# Altium schematic sheet Connectors.SchDoc
size 393 x 281 mm; DocumentNumber: 4; SheetNumber: 4; SheetTotal: 7; Format: A3; Abteilung: Entwicklung
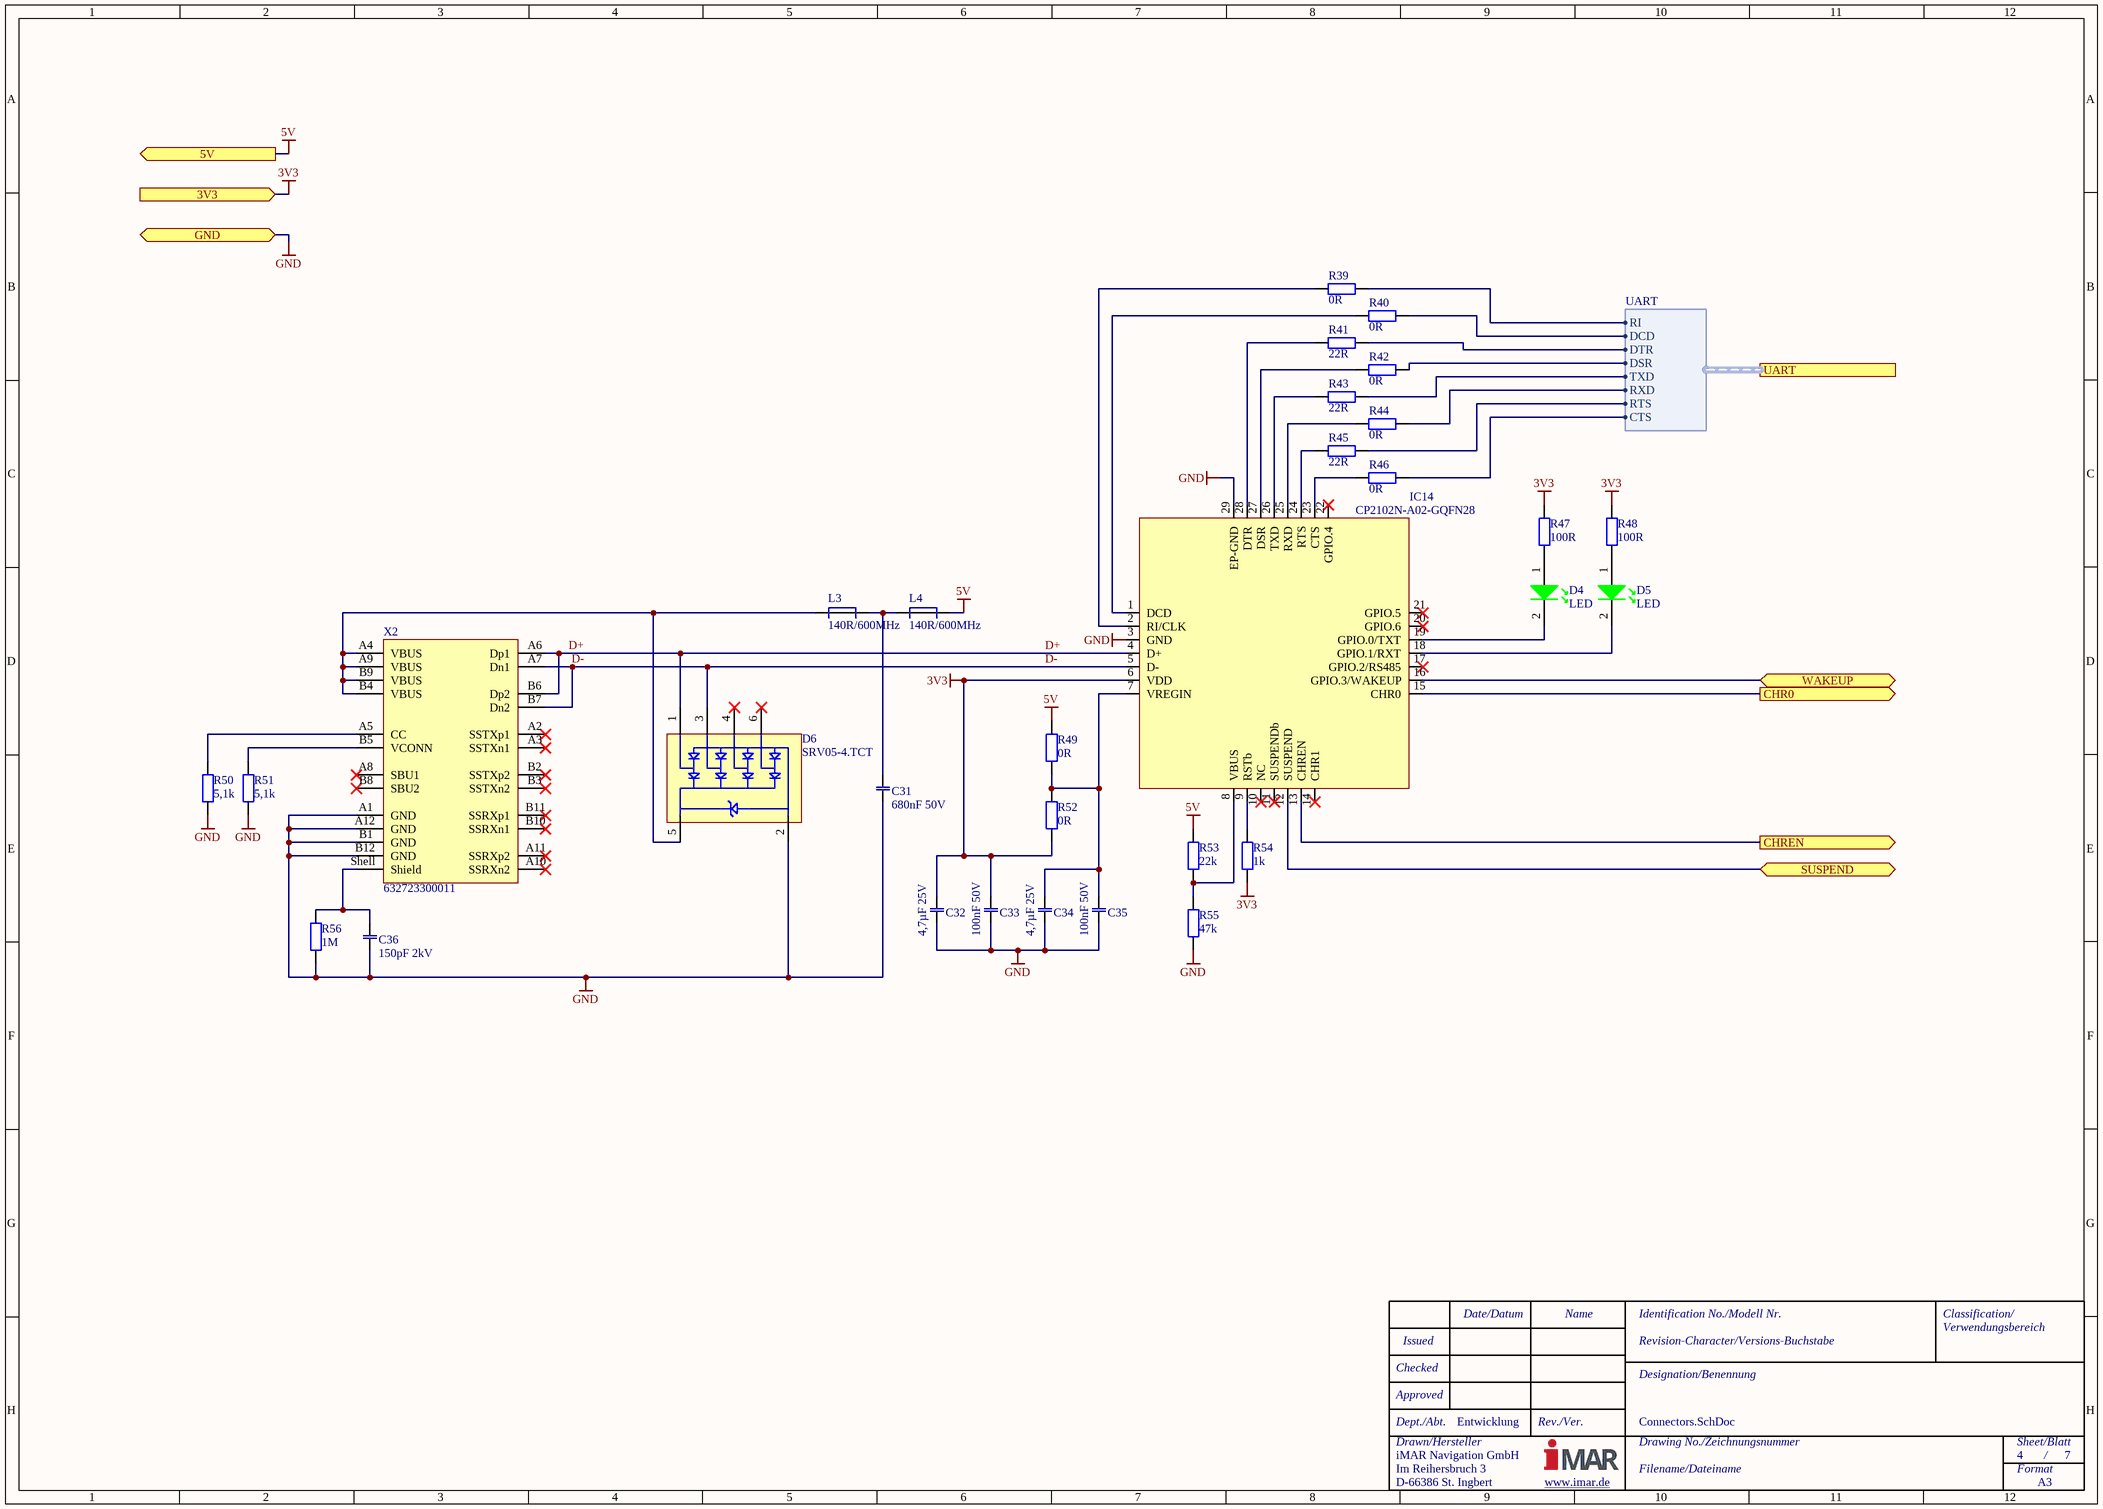
[diagram p0: Connectors.SchDoc]

## Parts
C31  680nF 50V  [CAPC1608L]
C32  4,7µF 25V  [CAPC1608L]
C33  100nF 50V  [CAPC1005N]
C34  4,7µF 25V  [CAPC1608L]
C35  100nF 50V  [CAPC1005N]
C36  150pF 2kV  [CAPC3216L]
D4  LED  [LEDM1608X11_Green]
D5  LED  [LEDM1608X11_Green]
D6  SRV05-4.TCT  [SOT95P280X110-6N]
IC14  CP2102N-A02-GQFN28  [QFN50P500X500X80_HS-29N]
L3  140R/600MHz  [INDC1005X06N]
L4  140R/600MHz  [INDC1005X06N]
R39  0R  [RESC1005L]
R40  0R  [RESC1005L]
R41  22R  [RESC1005L]
R42  0R  [RESC1005L]
R43  22R  [RESC1005L]
R44  0R  [RESC1005L]
R45  22R  [RESC1005L]
R46  0R  [RESC1005L]
R47  100R  [RESC1005L]
R48  100R  [RESC1005L]
R49  0R  [RESC1005L]
R50  5,1k  [RESC1005L]
R51  5,1k  [RESC1005L]
R52  0R  [RESC1005L]
R53  22k  [RESC1005L]
R54  1k  [RESC1005L]
R55  47k  [RESC1005L]
R56  1M  [RESC2012L]
X2  632723300011  [WE_632723300011]

## Ports
3V3 (in), 5V (out), CHR0 (out), CHREN (out), GND (bidir), SUSPEND (bidir), UART (harness UART), WAKEUP (bidir)

## Harnesses
UART: RXD, DSR, DTR, RTS, CTS, TXD, DCD, RI

## Nets
3V3: C32.2 C33.2 IC14.6(VDD) R47.2 R48.2 R52.2 R54.1 ; port 3V3
5V: L4.2 R49.2 R53.2 ; port 5V
GND: C31.1 C32.1 C33.1 C34.1 C35.1 C36.1 D6.2 IC14.3(GND) IC14.29(EP-GND) R50.1 R51.1 R55.1 R56.1 X2.A1(GND) X2.A12(GND) X2.B1(GND) X2.B12(GND) ; port GND
CHR0: IC14.15(CHR0) ; port CHR0
CHREN: IC14.13(CHREN) ; port CHREN
D+: D6.1 IC14.4(D+) X2.A6(Dp1) X2.B6(Dp2)
D-: D6.3 IC14.5(D-) X2.A7(Dn1) X2.B7(Dn2)
SUSPEND: IC14.12(SUSPEND) ; port SUSPEND
WAKEUP: IC14.16(GPIO.3/WAKEUP) ; port WAKEUP
NetC31_2: C31.2 L3.2 L4.1
NetC34_2: C34.2 C35.2 IC14.7(VREGIN) R49.1 R52.1
NetC36_2: C36.2 R56.2 X2.Shell(Shield)
NetD4_1: D4.1 R47.1
NetD4_2: D4.2 IC14.19(GPIO.0/TXT)
NetD5_1: D5.1 R48.1
NetD5_2: D5.2 IC14.18(GPIO.1/RXT)
NetD6_5: D6.5 L3.1 X2.A4(VBUS) X2.A9(VBUS) X2.B4(VBUS) X2.B9(VBUS)
NetIC14_1: IC14.1(DCD) R40.1
NetIC14_2: IC14.2(RI/CLK) R39.1
NetIC14_8: IC14.8(VBUS) R53.1 R55.2
NetIC14_9: IC14.9(RSTb) R54.2
NetIC14_23: IC14.23(CTS) R46.1
NetIC14_24: IC14.24(RTS) R45.2
NetIC14_25: IC14.25(RXD) R44.1
NetIC14_26: IC14.26(TXD) R43.1
NetIC14_27: IC14.27(DSR) R42.1
NetIC14_28: IC14.28(DTR) R41.2
NetR39_2: R39.2 ; port UART.RI
NetR40_2: R40.2 ; port UART.DCD
NetR41_1: R41.1 ; port UART.DTR
NetR42_2: R42.2 ; port UART.DSR
NetR43_2: R43.2 ; port UART.TXD
NetR44_2: R44.2 ; port UART.RXD
NetR45_1: R45.1 ; port UART.RTS
NetR46_2: R46.2 ; port UART.CTS
NetR50_2: R50.2 X2.A5(CC)
NetR51_2: R51.2 X2.B5(VCONN)

Not connected (* = marked no-connect by the designer): D6 4* 6*; IC14 10(NC)* 11(SUSPENDb)* 14(CHR1)* 17(GPIO.2/RS485)* 20(GPIO.6)* 21(GPIO.5)* 22(GPIO.4)*; X2 A2(SSTXp1)* A3(SSTXn1)* A8(SBU1)* A10(SSRXn2)* A11(SSRXp2)* B2(SSTXp2)* B3(SSTXn2)* B8(SBU2)* B10(SSRXn1)* B11(SSRXp1)*

## Notes on the sheet
- Date/Datum
- Name
- Identification No./Modell Nr.
- Classification/
- Checked
- Approved
- Issued
- Designation/Benennung
- Revision-Character/Versions-Buchstabe
- Verwendungsbereich
- Drawn/Hersteller
- Dept./Abt.
- iMAR Navigation GmbH
- Rev./Ver.
- Drawing No./Zeichnungsnummer
- Sheet/Blatt
- /
- Im Reihersbruch 3
- D-66386 St. Ingbert
- www.imar.de <http://www.imar.de>
- Filename/Dateiname
- Format
- A3

## Library data of the parts
C31 = CMP-002-0039-17: 680nF  50V  Ceramic  0603  10%  X5R; Manufacturer: unspecified; Failure_in_Time_notes: 55°C, 90% Upper Confidence Level, Daten von Wuerth verwendet; iMAR_PN: 00001-08266-0000; Temperature_max: 85°C; Failure_in_Time_value: 0,000123; Temperature_min: -55°C; Voltage: 50V; Tolerance: 10%; Kategorie: X5R; Value: 680nF; Manufacturer_PN: unspecified; RoHS: Yes; Capacitor_Type: Ceramic; Mount: SMD; iComment: 680nF 50V; Case/Package: 0603
C32 C34 = CMP-002-0204-3: 4,7µF  25V  Ceramic  0603  10%  X5R; Manufacturer_PN: unspecified; Temperature_min: -55°C; Temperature_max: 85°C; iMAR_PN: 00001-08279-0000; Failure_in_Time_notes: 55°C, 90% Upper Confidence Level, Daten von Wuerth verwendet; Failure_in_Time_value: 0,000123; iComment: 4.7µF 25V; Value: 4.7µF; RoHS: Yes; Manufacturer: unspecified; Mount: SMD; Capacitor_Type: Ceramic; Voltage: 25V; Kategorie: X5R; Tolerance: 10%; Case/Package: 0603
C33 C35 = CMP-002-0216-3: 100nF  50V  Ceramic  0402  10%  X7R; Manufacturer_PN: unspecified; Failure_in_Time_notes: 55°C, 90% Upper Confidence Level, Daten von Wuerth verwendet; Failure_in_Time_value: 0,000123; Temperature_min: -55°C; iMAR_PN: 00001-08791-0000; Temperature_max: 125°C; iComment: 100nF 50V; Capacitor_Type: Ceramic; Voltage: 50V; Mount: SMD; Case/Package: 0402; Manufacturer: unspecified; Kategorie: X7R; Tolerance: 10%; RoHS: Yes; Value: 100nF
C36 = CMP-002-0122-7: 150pF  2kV  Ceramic  1206  10%  X7R; Manufacturer: unspecified; Failure_in_Time_notes: 55°C, 90% Upper Confidence Level, Daten von Wuerth verwendet; iMAR_PN: 00001-08264-0000; Failure_in_Time_value: 0,000123; Temperature_min: -55°C; Temperature_max: 125°C; Mount: SMD; Capacitor_Type: Ceramic; RoHS: Yes; Kategorie: X7R; Value: 150pF; Tolerance: 10%; iComment: 150pF 2kV; Case/Package: 1206; Voltage: 2kV; Manufacturer_PN: unspecified
D4 D5 = CMP-008-0005-11: LED green 0603 2,2V 20mA; Manufacturer_PN: KP-1608SGC; Manufacturer: KINGBRIGHT; Temperature_max: 85°C; Uf_max: 2,5V; Ub: 5V; Temperature_min: -40°C; Uf: 2.2V; Failure_in_Time_notes: Ground Benign; MIL_HDBK_217F; Opto-Electronic/ Emitter; iMAR_PN: 00001-06615-0001; Power: 62.5mW; Failure_in_Time_value: 0,00047; Color: Green; Mount: SMD; Case/Package: 0603; Pins: 2; RoHS: Yes; If: 20mA; Type: LED
D6 = CMP-016-0045-9: Low Capacitance TVS Diode Array,USB, 10/100/1000 ETH; Manufacturer: SEMTECH; Temperature_max: 125°C; Type: TVS-Array; Failure_in_Time_value: 0,00038; Uf: 1.2V; iMAR_PN: 00001-07255-0000; Temperature_min: -55°C; Ub: 6V; Failure_in_Time_notes: 55°C (Junction), 90% Upper Confidence Level; Daten von ON Semiconductor; Power: 300W; If: 12A; Mount: SMD; Pins: 6; RoHS: Yes; Case/Package: SOT-23; Manufacturer_PN: SRV05-4.TCT
IC14 = CMP-ROOT-00311-6: USB-IC-Schnittstelle USBXpress - USB to UART Bridge; Manufacturer: SILICON LABS; iMAR_PN: 00001-09090-0000; Temperature_min: -40°C; Temperature_max: 85°C; Mount: SMD; RoHS: Yes; Case/Package: QFN28; Manufacturer_PN: CP2102N-A02-GQFN28; Pins: 29
L3 L4 = CMP-007-0093-9: 140R/600MHz  1,2A  0402  WE-CBF SMD EMI Suppression Ferrite Bead; Manufacturer: WUERTH ELEKTRONIK; Manufacturer_PN: 742792731; Temperature_max: 85°C; Temperature_min: -55°C; Failure_in_Time_value: 0,00025; Current_Rated: 1.2A; Temperature_extended: 125°C; Impedance_100MHz: 100; iMAR_PN: 00001-07703-0000; Impedance_DC: 90m; Frequency: 600MHz; Impedance: 140; Failure_in_Time_notes: 90% UCL (lambda: 0,13; sigma: 0,09); Mount: SMD; RoHS: Yes; Case/Package: 0402
R39 R40 R42 R44 R46 R49 R52 = CMP-001-0173-26: 0R  0402  0mW  0%  0ppm  0V; Manufacturer: unspecified; iMAR_PN: 00001-06483-0000; Temperature_min: -40°C; Failure_in_Time_notes: 55°C, 60% Upper Confidence Level; Daten von Vishay verwendet; iComment: 0; Power: 0W; Failure_in_Time_value: 0,0001; Value: 0; Temperature_max: 125°C; Voltage: 0V; Case/Package: 0402; Mount: SMD; Tolerance: 0%; TK: 0; RoHS: Yes; Manufacturer_PN: unspecified
R41 R43 R45 = CMP-001-0206-25: 22R  0402  62mW  1%  100ppm  50V; Manufacturer: unspecified; iComment: 22; Temperature_min: -40°C; Failure_in_Time_value: 0,0001; TK: ±100; Failure_in_Time_notes: 55°C, 60% Upper Confidence Level; Daten von Vishay verwendet; Temperature_max: 125°C; Value: 22; iMAR_PN: 00001-07283-0000; RoHS: Yes; Power: 62mW; Manufacturer_PN: unspecified; Case/Package: 0402; Tolerance: 1%; Voltage: 50V; Mount: SMD
R47 R48 = CMP-001-0222-23: 100R  0402  62mW  1%  100ppm  50V; Manufacturer_PN: unspecified; iMAR_PN: 00001-06144-0003; Failure_in_Time_notes: 55°C, 60% Upper Confidence Level; Daten von Vishay verwendet; Value: 100; Temperature_max: 125°C; Failure_in_Time_value: 0,0001; TK: ±100; Temperature_min: -40°C; RoHS: Yes; Tolerance: 1%; Power: 62mW; Case/Package: 0402; Mount: SMD; Voltage: 50V; Manufacturer: unspecified; iComment: 100
R50 R51 = CMP-001-0263-23: 5,1k  0402  62mW  1%  100ppm  50V; Manufacturer_PN: unspecified; Temperature_min: -40°C; Temperature_max: 125°C; Value: 5.1k; Failure_in_Time_value: 0,0001; TK: ±100; iMAR_PN: 00001-08410-0000; Failure_in_Time_notes: 55°C, 60% Upper Confidence Level; Daten von Vishay verwendet; RoHS: Yes; Case/Package: 0402; Manufacturer: unspecified; Mount: SMD; iComment: 5.1k; Voltage: 50V; Power: 62mW; Tolerance: 1%
R53 = CMP-001-0278-22: 22k  0402  62mW  1%  100ppm  50V; Manufacturer: unspecified; Temperature_min: -40°C; TK: ±100; Failure_in_Time_notes: 55°C, 60% Upper Confidence Level; Daten von Vishay verwendet; Temperature_max: 125°C; iMAR_PN: 00001-08143-0000; Failure_in_Time_value: 0,0001; Voltage: 50V; Case/Package: 0402; Mount: SMD; Power: 62mW; Value: 22k; Tolerance: 1%; Manufacturer_PN: unspecified; RoHS: Yes; iComment: 22k
R54 = CMP-001-0246-24: 1k  0402  62mW  1%  100ppm  50V; Manufacturer: unspecified; Temperature_min: -40°C; Failure_in_Time_value: 0,0001; iMAR_PN: 00001-06144-0005; Temperature_max: 125°C; Failure_in_Time_notes: 55°C, 60% Upper Confidence Level; Daten von Vishay verwendet; TK: ±100; Power: 62mW; Value: 1k; Tolerance: 1%; Voltage: 50V; Mount: SMD; RoHS: Yes; iComment: 1k; Case/Package: 0402; Manufacturer_PN: unspecified
R55 = CMP-001-0286-24: 47k  0402  62mW  1%  100ppm  50V; Manufacturer: unspecified; iMAR_PN: 00001-07334-0000; Temperature_max: 125°C; Temperature_min: -40°C; Failure_in_Time_value: 0,0001; Failure_in_Time_notes: 55°C, 60% Upper Confidence Level; Daten von Vishay verwendet; TK: ±100; Power: 62mW; Manufacturer_PN: unspecified; Tolerance: 1%; Value: 47k; Mount: SMD; RoHS: Yes; iComment: 47k; Voltage: 50V; Case/Package: 0402
R56 = CMP-001-0148-18: 1M  0805  125mW  1%  100ppm  150V; Manufacturer_PN: unspecified; TK: ±100; Temperature_max: 125°C; Failure_in_Time_value: 0,0001; Failure_in_Time_notes: 55°C, 60% Upper Confidence Level; Daten von Vishay verwendet; Temperature_min: -40°C; iMAR_PN: 00001-00758-0000; Value: 1M; Mount: SMD; Manufacturer: unspecified; iComment: 1M; Power: 125mW; RoHS: Yes; Voltage: 150V; Tolerance: 1%; Case/Package: 0805
X2 = CMP-ROOT-00523-2: WR-COM USB 3.1 Type C Receptacle Horizontal THR / SMT; pin to pad: Shell>1+2+3+4+5+6+7+8; Manufacturer: WUERTH ELEKTRONIK; 3TG_Conformity: Yes; Temperature_min: -40°C; Number_of_Rows: 2; System: Connector; Temperature_max: 105°C; iMAR_PN: tbd; Pitch: 0,5; Connector_Type: btw; Pins: 24; Mount: TH; Manufacturer_PN: 632723300011; RoHS: Yes